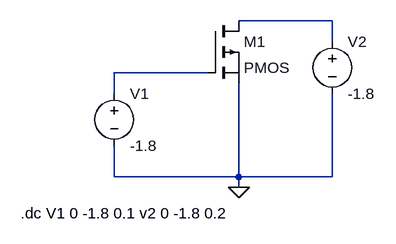
[diagram p0: schematic Pmos_exp1 vanisha.asc]
Pmos_exp1 vanisha.asc, the LTspice schematic file:
Version 4
SHEET 1 880 680
WIRE 384 128 240 128
WIRE 384 160 384 128
WIRE 192 208 48 208
WIRE 48 240 48 208
WIRE 48 368 48 320
WIRE 240 368 240 224
WIRE 240 368 48 368
WIRE 384 368 384 240
WIRE 384 368 240 368
WIRE 240 384 240 368
FLAG 240 384 0
SYMBOL pmos 192 128 R0
SYMATTR InstName M1
SYMBOL voltage 48 224 R0
WINDOW 123 0 0 Left 0
WINDOW 39 0 0 Left 0
SYMATTR InstName V1
SYMATTR Value -1.8
SYMBOL voltage 384 144 R0
SYMATTR InstName V2
SYMATTR Value -1.8
TEXT -96 424 Left 2 !.dc V1 0 -1.8 0.1 v2 0 -1.8 0.2

The netlist it stands for:
* Pmos_exp1 vanisha.asc
M1 N001 N002 0 0 PMOS
V1 N002 0 -1.8
V2 N001 0 -1.8
.model NMOS NMOS
.model PMOS PMOS
.lib standard.mos
.dc V1 0 -1.8 0.1 v2 0 -1.8 0.2
.backanno
.end